# Altium schematic sheet Carte_Barriere_Optique.SchDoc
size A4; Author: Audran; CompanyName: Goldorak; Address1: Electrolab; Address2: 52 rue Paul Lescop; Address3: 92000 Nanterre; ProjectName: Cartes_2017
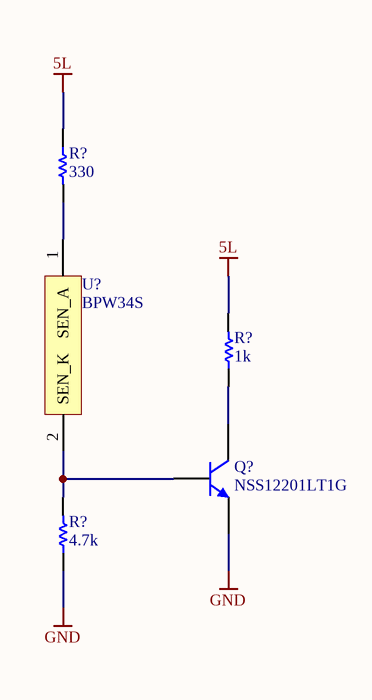
[diagram p0: Carte_Barriere_Optique.SchDoc]

## Parts
(Parts that share a designator on the sheet are numbered #1, #2 ... from top to bottom, then left to right.)
Q?  NSS12201LT1G  [SOT-23]
R?#1  value 330  [RESC1608X06N]  (hidden comment: RC0603FR-07330RL)
R?#2  value 1k  [RESC1608X06N]  (hidden comment: RC0603FR-071KL)
R?#3  value 4.7k  [RESC1005X04N]
U?  BPW34S  [BPW34]

## Nets
5L: R?#1.1 R?#2.2
GND: Q?.2(E) R?#3.1
NetQ?_1: Q?.1(B) R?#3.2 U?.2(SEN_K)
NetQ?_3: Q?.3(C) R?#2.1
NetR?#1_2: R?#1.2 U?.1(SEN_A)

## Library data of the parts
Q? = NSS12201LT1G: Bipolar (BJT) Transistor NPN 12V 2A 150MHz 460mW Surface Mount SOT-23-3 (TO-236); Manufacturer 1: ON SEMICONDUCTOR; ComponentLink1Description: References; ComponentLink1URL: http://www.farnell.com/datasheets/2353901.pdf; Supplier 1: Farnell; Supplier Part Number 1: 2535657; Manufacturer Part Number: NSS12201LT1G
R?#1 = RC0603FR-07330RL: RES SMD 330 OHM 1% 1/10W 0603; Manufacturer: Yageo; Power: 100mW; Vmax: 50V; Manufacturer Part Number: RC0603FR-07330RL; Type: Thick Film; ComponentLink1Description: Manufacturer; ComponentLink1URL: http://www.yageo.com/NewPortal/_en/index.jsp; ComponentLink2Description: Datasheet; ComponentLink2URL: http://www.farnell.com/datasheets/2167052.pdf; Supplier 1: Farnell; Supplier Part Number 1: 9238425; Precision: ±1%
R?#2 = RC0603FR-071KL: RES SMD 1K OHM 1% 1/10W 0603; Manufacturer: Yageo; Power: 100mW; Vmax: 50V; Manufacturer Part Number: RC0603FR-071KL; Type: Thick Film; ComponentLink1Description: Manufacturer; ComponentLink1URL: http://www.yageo.com/NewPortal/_en/index.jsp; ComponentLink2Description: Datasheet; ComponentLink2URL: http://www.farnell.com/datasheets/2167052.pdf; Precision: ±1%; Supplier 1: Farnell; Supplier Part Number 1: 9238484
R?#3 = RC0402FR-074K7L: RES SMD 4K7 OHM 1% 1/16W 0402; Manufacturer: Yageo; Power: 63mW; Vmax: 50V; Type: Thick Film; ComponentLink1Description: Manufacturer; ComponentLink1URL: http://www.yageo.com/NewPortal/_en/index.jsp; ComponentLink2Description: Datasheet; ComponentLink2URL: http://www.farnell.com/datasheets/2167052.pdf; Manufacturer Part Number: RC0402FR-074K7L; Supplier 1: Farnell; Supplier Part Number 1: 9239316; Precision: ±1%
U? = BPW34S: Photodiode 850nm 20ns 120° 2-SMD, Gull Wing; Manufacturer: OSRAM; Manufacturer Part Number: BPW34S; Pricing: 0.83; ComponentLink1URL: http://www.farnell.com/datasheets/45577.pdf; ComponentLink1Description: Datasheet; Supplier 1: Farnell; Supplier Part Number 1: 1212745